# Altium schematic sheet 04_PWMDRIVER.SchDoc
size A; SheetNumber: 4; SheetTotal: 5
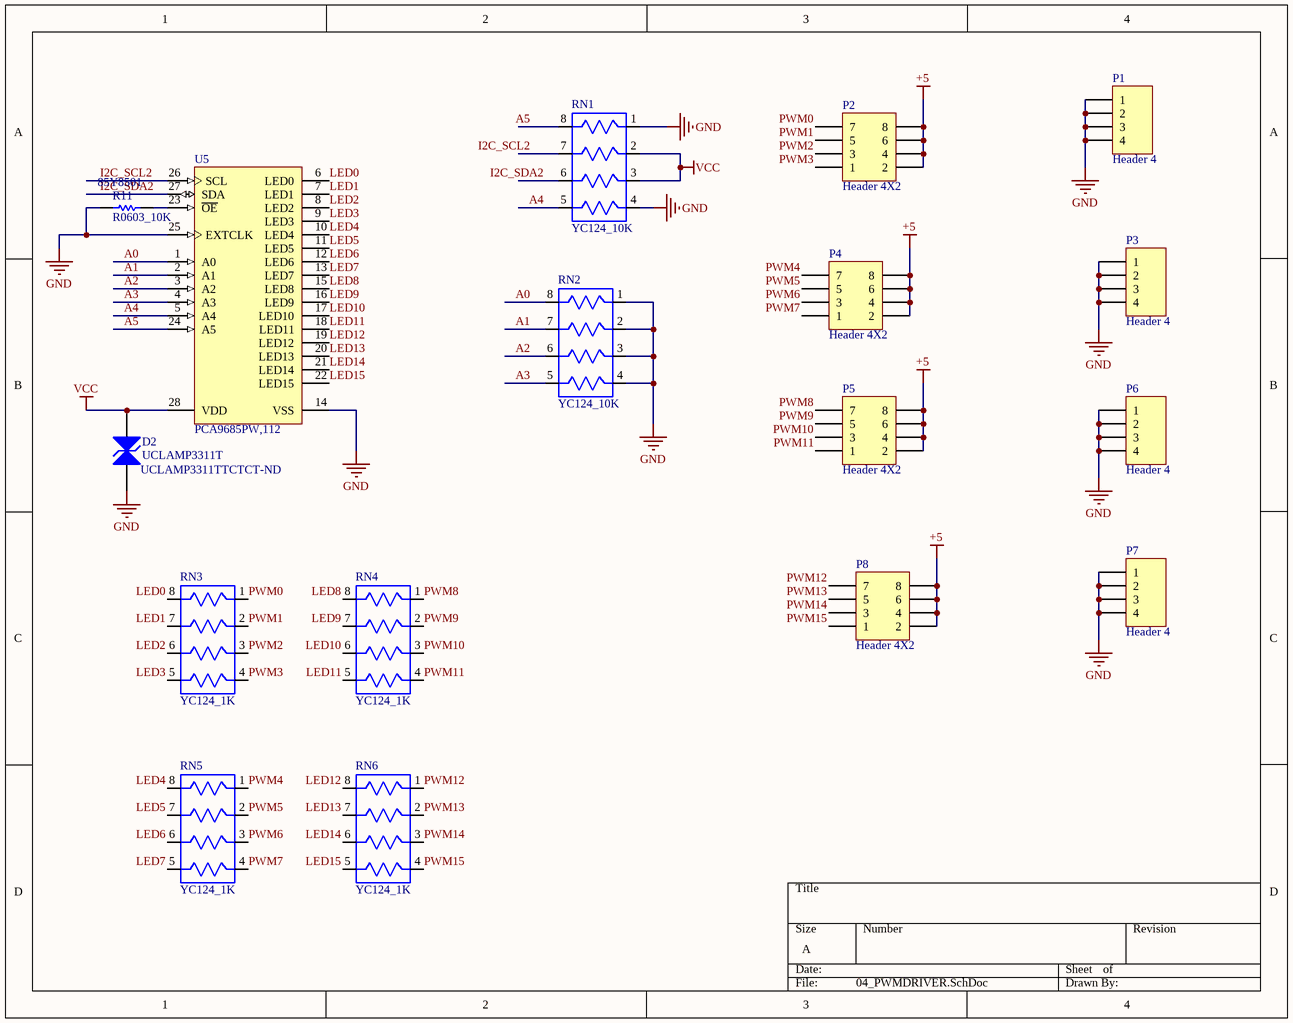
[diagram p0: 04_PWMDRIVER.SchDoc]

## Parts
D2  UCLAMP3311T  Supplier Part Number 1: UCLAMP3311TTCTCT-ND  [SEMT-SLP1006P2-2_V]
P1  Header 4  [HDR1X4]
P2  Header 4X2  [HDR2X4]
P3  Header 4  [HDR1X4]
P4  Header 4X2  [HDR2X4]
P5  Header 4X2  [HDR2X4]
P6  Header 4  [HDR1X4]
P7  Header 4  [HDR1X4]
P8  Header 4X2  [HDR2X4]
R11  R0603_10K  Supplier Part Number 1: 85Y8501  [RESC1609X55X30LL15T15]
RN1  YC124_10K  [YC124]
RN2  YC124_10K  [YC124]
RN3  YC124_1K  [YC124]
RN4  YC124_1K  [YC124]
RN5  YC124_1K  [YC124]
RN6  YC124_1K  [YC124]
U5  PCA9685PW,112  [SOT361-1_V]

## Nets
+5: P2.2 P2.4 P2.6 P2.8 P4.2 P4.4 P4.6 P4.8 P5.2 P5.4 P5.6 P5.8 P8.2 P8.4 P8.6 P8.8
GND: D2.1(A) P1.1 P1.2 P1.3 P1.4 P3.1 P3.2 P3.3 P3.4 P6.1 P6.2 P6.3 P6.4 P7.1 P7.2 P7.3 P7.4 R11.1 RN1.1 RN1.4 RN2.1 RN2.2 RN2.3 RN2.4 U5.14(VSS) U5.25(EXTCLK)
VCC: D2.2(A) RN1.2 RN1.3 U5.28(VDD)
A0: RN2.8 U5.1(A0)
A1: RN2.7 U5.2(A1)
A2: RN2.6 U5.3(A2)
A3: RN2.5 U5.4(A3)
A4: RN1.5 U5.5(A4)
A5: RN1.8 U5.24(A5)
I2C_SCL2: RN1.7 U5.26(SCL)
I2C_SDA2: RN1.6 U5.27(SDA)
LED0: RN3.8 U5.6(LED0)
LED1: RN3.7 U5.7(LED1)
LED2: RN3.6 U5.8(LED2)
LED3: RN3.5 U5.9(LED3)
LED4: RN5.8 U5.10(LED4)
LED5: RN5.7 U5.11(LED5)
LED6: RN5.6 U5.12(LED6)
LED7: RN5.5 U5.13(LED7)
LED8: RN4.8 U5.15(LED8)
LED9: RN4.7 U5.16(LED9)
LED10: RN4.6 U5.17(LED10)
LED11: RN4.5 U5.18(LED11)
LED12: RN6.8 U5.19(LED12)
LED13: RN6.7 U5.20(LED13)
LED14: RN6.6 U5.21(LED14)
LED15: RN6.5 U5.22(LED15)
PWM0: P2.7 RN3.1
PWM1: P2.5 RN3.2
PWM2: P2.3 RN3.3
PWM3: P2.1 RN3.4
PWM4: P4.7 RN5.1
PWM5: P4.5 RN5.2
PWM6: P4.3 RN5.3
PWM7: P4.1 RN5.4
PWM8: P5.7 RN4.1
PWM9: P5.5 RN4.2
PWM10: P5.3 RN4.3
PWM11: P5.1 RN4.4
PWM12: P8.7 RN6.1
PWM13: P8.5 RN6.2
PWM14: P8.3 RN6.3
PWM15: P8.1 RN6.4
NetR11_2: R11.2 U5.23(~{OE})

## Library data of the parts
D2 = TVS_CLAMP: SEMTECH - UCLAMP3311T.TCT - TVS ARRAY, 40W, 3.3V, BI-DIRECTIONAL, SLP1006P2T; Direction: Bidirectional; Clamping Voltage: 8V; Element Configuration: Single; Number of Bidirectional Channels: 1; Min Breakdown Voltage: 3.5V; Power Line Protection: No; Leakage Current: 50nA; Peak Pulse Current: 5A; Diode Type: ZENER; Supplier 1: Digi-Key; Manufacturer: Semtech; Manufacturer Part Number: UCLAMP3311T.TCT; RoHS: Yes; Category: TVS Diodes; Stock 1: 13131; Pricing 1: 1=0.74000, 10=0.65300, 100=0.50090, 500=0.39600, 1000=0.31680 (USD); Mount: Surface Mount; Case/Package: 0402; Number of Pins: 2; Case Code (Metric): 1006; Case Code (Imperial): 0402; Min Operating Temperature: -40°C; Max Operating Temperature: 85°C; Working Voltage: 3.3V; Packaging: Tape and Reel; Reverse Standoff Voltage: 3.3V; Peak Pulse Power: 40W; Resistor Type: Zener; Series: uClamp®; Length: 1mm; Depth: 0.6mm; Radiation Hardening: No; RoHS Compliant: Yes; ComponentLink1URL: https://datasheet.ciiva.com/25956/uclamp3311t-25956948.pdf?src-supplier=Avnet+Europe; ComponentLink1Description: https://datasheet.ciiva.com/25956/uclamp3311t-25956948.pdf?src-supplier=Avnet+Europe; ComponentLink2URL: https://datasheet.ciiva.com/11195/uclamp3311t-11195117.pdf?src-supplier=Avnet; ComponentLink2Description: https://datasheet.ciiva.com/11195/uclamp3311t-11195117.pdf?src-supplier=Avnet; ComponentLink3URL: https://datasheet.ciiva.com/29588/uclamp3311t-29588805.pdf?src-supplier=Digi-Key; ComponentLink3Description: https://datasheet.ciiva.com/29588/uclamp3311t-29588805.pdf?src-supplier=Digi-Key; ComponentLink4URL: https://datasheet.ciiva.com/29588/uclamp3311t-29588806.pdf?src-supplier=Digi-Key; ComponentLink4Description: https://datasheet.ciiva.com/29588/uclamp3311t-29588806.pdf?src-supplier=Digi-Key; ComponentLink5URL: https://datasheet.ciiva.com/29588/uclamp3311t-29588807.pdf?src-supplier=Digi-Key; ComponentLink5Description: https://datasheet.ciiva.com/29588/uclamp3311t-29588807.pdf?src-supplier=Digi-Key
P1 P3 P6 P7 = Header 4: Header, 4-Pin; LatestRevisionDate: 17-Jul-2002; LatestRevisionNote: Re-released for DXP Platform.; Publisher: Altium Limited
P2 P4 P5 P8 = Header 4X2: Header, 4-Pin, Dual row; LatestRevisionDate: 17-Jul-2002; LatestRevisionNote: Re-released for DXP Platform.; Publisher: Altium Limited
R11 = R0603: PANASONIC - ERJ-3EKF1002V. - THICK FILM CHIP RES, 0603, 1%, PRECISION; Resistance: 10kR; Power Rating: 100mW; Temperature Coefficient: 100ppm/°C; Voltage Rating: 75V; Supplier 1: Newark; Manufacturer: Panasonic; Manufacturer Part Number: ERJ-3EKF1002V; RoHS: Yes; Category: Chip SMD Resistors; Stock 1: 27295001; Pricing 1: 5000=0.00900, 10000=0.00900 (USD); Mount: Surface Mount; Case/Package: 0603; Number of Pins: 2; Case Code (Metric): 1608; Case Code (Imperial): 0603; Contact Plating: Tin; Size Code: 0603; Min Operating Temperature: -55°C; Max Operating Temperature: 155°C; Packaging: Tape and Reel; Resistor Type: Thick Film; Number of Terminations: 2; Max Power Dissipation: 100mW; Tolerance: 1%; Series: ERJ; Construction: Rectangular; Features: Automotive AEC-Q200; Package Quantity: 1; Voltage Rating (DC): 75V; Termination: SMD/SMT; Resistance Tolerance: 1%; Technology: THICK FILM; Length: 1.6mm; Width: 0.031inch; Height: 0.45mm; Depth: 0.8mm; Radiation Hardening: No; Military Standard: Not; Lead Free: Lead Free; RoHS Compliant: Yes; REACH SVHC: No SVHC; ComponentLink1URL: https://datasheet.ciiva.com/48530/aoa0000ce2-48530988.pdf?src-supplier=Avnet; ComponentLink1Description: https://datasheet.ciiva.com/48530/aoa0000ce2-48530988.pdf?src-supplier=Avnet; ComponentLink2URL: https://datasheet.ciiva.com/24070/aoa0000ce2-24070318.pdf?src-supplier=Mouser; ComponentLink2Description: https://datasheet.ciiva.com/24070/aoa0000ce2-24070318.pdf?src-supplier=Mouser; ComponentLink3URL: https://datasheet.ciiva.com/9194/aoa0000ce2-9194199.pdf?src-supplier=Avnet; ComponentLink3Description: https://datasheet.ciiva.com/9194/aoa0000ce2-9194199.pdf?src-supplier=Avnet; ComponentLink4URL: https://datasheet.ciiva.com/30208/aoa0000ce2-30208985.pdf?src-supplier=Onlinecomponents.com; ComponentLink4Description: https://datasheet.ciiva.com/30208/aoa0000ce2-30208985.pdf?src-supplier=Onlinecomponents.com; ComponentLink5URL: https://datasheet.ciiva.com/16759/70260748-16759807.pdf?src-supplier=Allied+Electronics; ComponentLink5Description: https://datasheet.ciiva.com/16759/70260748-16759807.pdf?src-supplier=Allied+Electronics; ComponentLink6URL: https://datasheet.ciiva.com/7830/aoa0000ce2-7830729.pdf?src-supplier=Element14; ComponentLink6Description: https://datasheet.ciiva.com/7830/aoa0000ce2-7830729.pdf?src-supplier=Element14; ComponentLink7URL: https://datasheet.ciiva.com/28514/426256-28514198.pdf?src-supplier=Element14; ComponentLink7Description: https://datasheet.ciiva.com/28514/426256-28514198.pdf?src-supplier=Element14; ComponentLink8URL: https://datasheet.ciiva.com/46372/1678782-46372725.pdf?src-supplier=Element14; ComponentLink8Description: https://datasheet.ciiva.com/46372/1678782-46372725.pdf?src-supplier=Element14; ComponentLink9URL: https://datasheet.ciiva.com/16511/aoa0000ce2-16511861.pdf?src-supplier=Avnet+Asia; ComponentLink9Description: https://datasheet.ciiva.com/16511/aoa0000ce2-16511861.pdf?src-supplier=Avnet+Asia; ComponentLink10URL: https://datasheet.ciiva.com/17212/aoa0000ce2-17212105.pdf?src-supplier=Avnet+Europe; ComponentLink10Description: https://datasheet.ciiva.com/17212/aoa0000ce2-17212105.pdf?src-supplier=Avnet+Europe
RN1-RN6 = YC124
U5 = CMP-1595-00004-2: 16-Channel, 12-Bit PWM Fm+ I2C-Bus LED Controller, 2.3 to 5.5 V, -40 to 85 degC, 28-Pin TSSOP (SOT361-1), RoHS, Tape and Reel; Supply Current Max: 10 mA; Supply Voltage Min: 2.3 V; Supply Voltage Max: 5.5 V; Frequency: 25000000 Hz; Temperature Min: -40 degC; PackageDescription: 28-Pin Small Outline Package, Body 9.7 x 4.4 mm, Pitch 0.65 mm; RoHS: TRUE; ComponentLink1Description: Manufacturer URL; Code_JEDEC: MO-153; PartNumber: PCA9685; ComponentLink2URL: http://www.nxp.com/documents/data_sheet/PCA9685.pdf; Packing: Tape and Reel; ComponentLink1URL: http://www.nxp.com/; ComponentLink3Description: Package Specification; ComponentLink2Description: Datasheet; ComponentLink3URL: http://www.nxp.com/documents/outline_drawing/sot361-1_po.pdf; DatasheetVersion: Rev. 4; Temperature Max: 85 degC; PackageVersion: 02/2003; Mounting Technology: Surface Mount